# Altium schematic sheet driver0-3.SchDoc
size A4; SheetNumber: 3; SheetTotal: 4
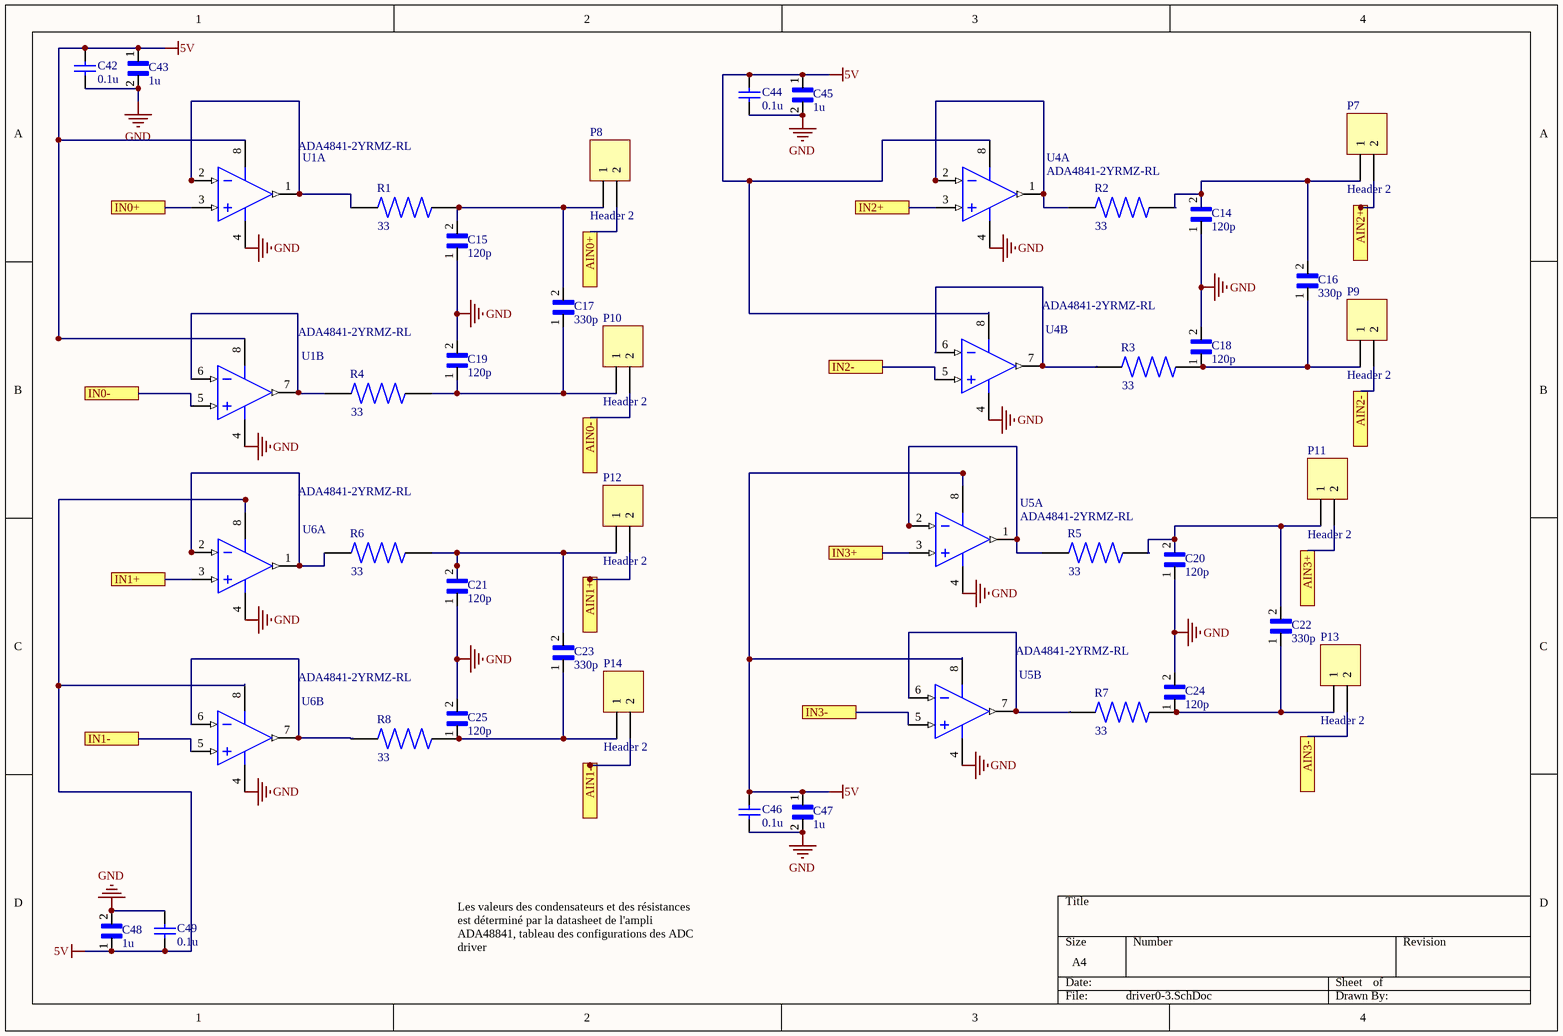
[diagram p0: driver0-3.SchDoc]

## Parts
C14  120p  [CAPC3216X94N]
C15  120p  [CAPC3216X94N]
C16  330p  [CAPC3216X94N]
C17  330p  [CAPC3216X94N]
C18  120p  [CAPC3216X94N]
C19  120p  [CAPC3216X94N]
C20  120p  [CAPC3216X94N]
C21  120p  [CAPC3216X94N]
C22  330p  [CAPC3216X94N]
C23  330p  [CAPC3216X94N]
C24  120p  [CAPC3216X94N]
C25  120p  [CAPC3216X94N]
C42  0.1u  [CAPC3216X94X50ML20T25]
C43  1u  [CAPC3216X127N]
C44  0.1u  [CAPC3216X94X50ML20T25]
C45  1u  [CAPC3216X127N]
C46  0.1u  [CAPC3216X94X50ML20T25]
C47  1u  [CAPC3216X127N]
C48  1u  [CAPC3216X127N]
C49  0.1u  [CAPC3216X94X50ML20T25]
P7  Header 2  [HDR1X2]
P8  Header 2  [HDR1X2]
P9  Header 2  [HDR1X2]
P10  Header 2  [HDR1X2]
P11  Header 2  [HDR1X2]
P12  Header 2  [HDR1X2]
P13  Header 2  [HDR1X2]
P14  Header 2  [HDR1X2]
R1  33  [RESC3116X75N]
R2  33  [RESC3116X75N]
R3  33  [RESC3116X75N]
R4  33  [RESC3116X75N]
R5  33  [RESC3116X75N]
R6  33  [RESC3116X75N]
R7  33  [RESC3116X75N]
R8  33  [RESC3116X75N]
U1  ADA4841-2YRMZ-RL  [ADI-RM-8_M]  (parts A,B of 2)
U4  ADA4841-2YRMZ-RL  [ADI-RM-8_M]  (parts A,B of 2)
U5  ADA4841-2YRMZ-RL  [ADI-RM-8_M]  (parts A,B of 2)
U6  ADA4841-2YRMZ-RL  [ADI-RM-8_M]  (parts A,B of 2)

## Ports
AIN0+, AIN0-, AIN1+, AIN1-, AIN2+, AIN2-, AIN3+, AIN3-, IN0+, IN0-, IN1+, IN1-, IN2+, IN2-, IN3+, IN3-

## Nets
5V: C42.1 C43.1 C44.1 C45.1 C46.1 C47.1 C48.1 C49.1 U1.8(+VS) U4.8(+VS) U5.8(+VS) U6.8(+VS)
GND: C14.1 C15.1 C18.2 C19.2 C20.1 C21.1 C24.2 C25.2 C42.2 C43.2 C44.2 C45.2 C46.2 C47.2 C48.2 C49.2 U1.4(-VS) U4.4(-VS) U5.4(-VS) U6.4(-VS)
AIN0+: P8.2 ; port AIN0+
AIN0-: P10.2 ; port AIN0-
AIN1+: P12.2 ; port AIN1+
AIN1-: P14.2 ; port AIN1-
AIN2+: P7.2 ; port AIN2+
AIN2-: P9.2 ; port AIN2-
AIN3+: P11.2 ; port AIN3+
AIN3-: P13.2 ; port AIN3-
IN0+: U1.3(+IN_1) ; port IN0+
IN0-: U1.5(+IN_2) ; port IN0-
IN1+: U6.3(+IN_1) ; port IN1+
IN1-: U6.5(+IN_2) ; port IN1-
IN2+: U4.3(+IN_1) ; port IN2+
IN2-: U4.5(+IN_2) ; port IN2-
IN3+: U5.3(+IN_1) ; port IN3+
IN3-: U5.5(+IN_2) ; port IN3-
NetC14_2: C14.2 C16.2 P7.1 R2.2
NetC15_2: C15.2 C17.2 P8.1 R1.2
NetC16_1: C16.1 C18.1 P9.1 R3.2
NetC17_1: C17.1 C19.1 P10.1 R4.2
NetC20_2: C20.2 C22.2 P11.1 R5.2
NetC21_2: C21.2 C23.2 P12.1 R6.2
NetC22_1: C22.1 C24.1 P13.1 R7.2
NetC23_1: C23.1 C25.1 P14.1 R8.2
NetR1_1: R1.1 U1.1(OUT_1) U1.2(-IN_1)
NetR2_1: R2.1 U4.1(OUT_1) U4.2(-IN_1)
NetR3_1: R3.1 U4.6(-IN_2) U4.7(OUT_2)
NetR4_1: R4.1 U1.6(-IN_2) U1.7(OUT_2)
NetR5_1: R5.1 U5.1(OUT_1) U5.2(-IN_1)
NetR6_1: R6.1 U6.1(OUT_1) U6.2(-IN_1)
NetR7_1: R7.1 U5.6(-IN_2) U5.7(OUT_2)
NetR8_1: R8.1 U6.6(-IN_2) U6.7(OUT_2)

## Notes on the sheet
- Les valeurs des condensateurs et des résistances est déterminé par la datasheet de l'ampli ADA48841, tableau des configurations des ADC driver

## Library data of the parts
C14 C15 C18-C21 C24 C25 = 12061A121JAT2A: CERAMIC CAPACITOR 120PF 100V, C0G, 5%, 1206; MF: {'manufacturer': u'AVX'}; Value: *; Package: None; MP: 12061A121JAT2A; Price: None; Availability: Unavailable
C16 C17 C22 C23 = 12065A331JAT2A: Ceramic Multilayer Capacitor; Capacitor Type:General Purpose; Capacitance:330pF; Capacitance Tolerance:Â± 5%; Voltage Rating:50VDC; Capacitor Dielectric Type:Multilayer Ceramic; Package/Case:1206; Termination Type:SMD ;RoHS Compliant: Yes; MF: {'manufacturer': u'AVX'}; Value: *; Package: None; MP: 12065A331JAT2A; Price: None; Availability: Unavailable
C42 C44 C46 C49 = CMP-2000-05018-1: Chip Capacitor, Ceramic, 100 nF, 10%, 50 V, 1206, RoHS, Tape and Reel; Manufacturer: AVX; Rated Voltage: 50V; Dielectric: X7R; Capacitance: 100nF; Datasheet URL: http://www.mouser.com/ds/2/40/cauto-360.pdf; Manufacturer URL: http://www.avx.com/; Datasheet Version: Sep-14; Tolerance (%): ±10%; Case Size/Dimension: 1206
C43 C45 C47 C48 = 1206YC105KAT2A: Cap Ceramic 1uF 16V X7R 10% SMD 1206 125ÂÂŽ T/R; MF: {'manufacturer': u'AVX'}; Value: *; Package: None; MP: 1206YC105KAT2A; Price: None; Availability: Unavailable
P7-P14 = Header 2: Header, 2-Pin; LatestRevisionDate: 17-Jul-2002; LatestRevisionNote: Re-released for DXP Platform.; Publisher: Altium Limited
R1-R8 = RTAN1206BKE33R0: MF: {'manufacturer': u'Stackpole Electronics Inc'}; Value: *; Package: None; MP: RTAN1206BKE33R0; Price: None; Availability: Unavailable
U1 U4-U6 = CMP-0384-01677-1: Double Channel Low Wide Band Noise Operational Amplifier, 80 MHz BW, 13 V/us SR, Industrial, 8-pin SOP (RM-8), Reel; Manufacturer: Analog Devices; Slew Rate: 13V/us; Iq/Amp: 1.5mA; Amplifiers Per Package: 2; Small Signal Bandwidth: 80MHz; V Span Min: 2.7V; V Span Max: 12V; Input Offset Voltage: 40uV; Input Bias Current: 3uA; ComponentLink3URL: http://www.analog.com/static/imported-files/packages/PKG_PDF/MSOP%28RM%29/RM_8.pdf; PartNumber: ADA4841-2YRMZ-RL; Mounting Technology: Surface Mount; DatasheetVersion: Rev. E; PackageDescription: 8-Pin Mini Small Outline Package, Body 3 x 3 mm, Pitch 0.65 mm; PackageReference: RM-8; ComponentLink2URL: http://www.analog.com/static/imported-files/data_sheets/ADA4841-1_4841-2.pdf; ComponentLink1Description: Manufacturer URL; ComponentLink2Description: Datasheet; Generic Part Number: ADA4841-2; ComponentLink1URL: http://www.analog.com/en/index.html; Code_JEDEC: MO-187-AA; ComponentLink3Description: Package Specification